# Altium schematic sheet MCU.SchDoc
size A3; SheetNumber: 7; SheetTotal: 7
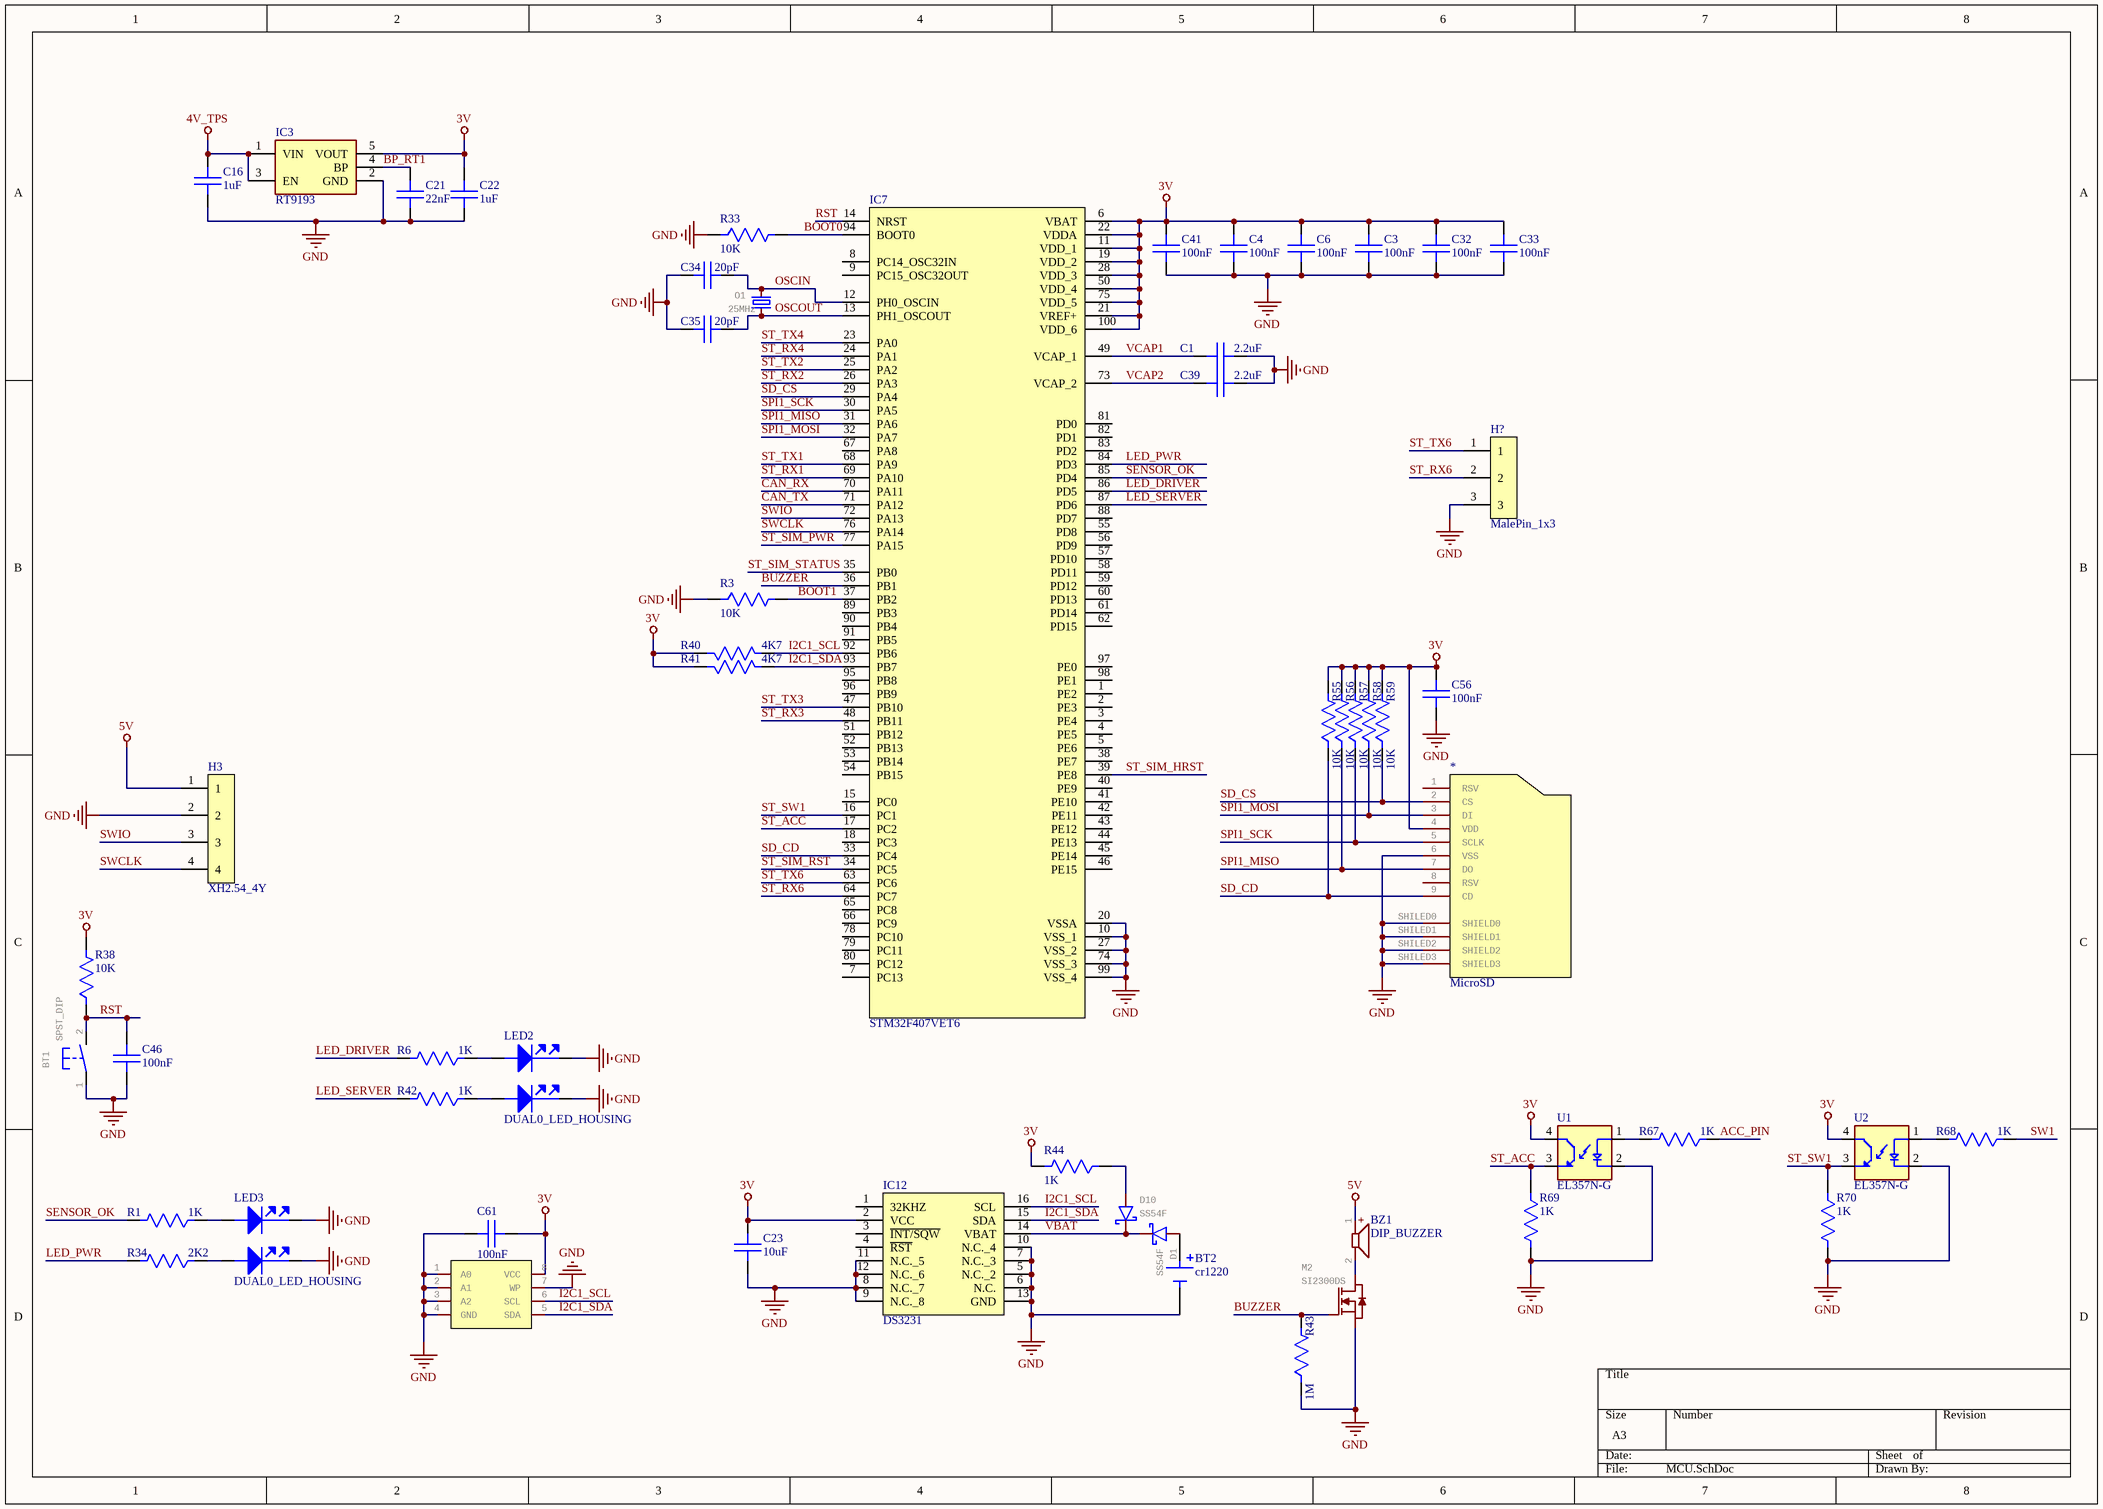
[diagram p0: MCU.SchDoc]

## Parts
*  MicroSD  [SD_MiSD-PP-9P-V1]
BT1  SPST_DIP  [SPST_BUTTON_2DIP]
BT2  cr1220  [cr1220]
BZ1  DIP_BUZZER  [DIP_BUZZER]
C1  2.2uF  [C0603]
C3  100nF  [C0603]
C4  100nF  [C0603]
C6  100nF  [C0603]
C16  1uF  [C0603]
C21  22nF  [C0603]
C22  1uF  [C0603]
C23  10uF  [C0603]
C32  100nF  [C0603]
C33  100nF  [C0603]
C34  20pF  [C0603]
C35  20pF  [C0603]
C39  2.2uF  [C0603]
C41  100nF  [C0603]
C46  100nF  [C0603]
C56  100nF  [C0603]
C61  100nF  [C0603]
D1  SS54F  [SMAF]
D10  SS54F  [SMAF]
H3  XH2.54_4Y  [JST-XH-04-PACKAGE-LONG-PAD]
H?  MalePin_1x3  [MALEPIN_1x3]
IC3  RT9193  [SOT-23-5]
IC7  STM32F407VET6  [LQFP100]
IC11  24LC0XX  [SOIC-8]  (value not drawn)
IC12  DS3231  [SOP-16]
LED2  DUAL0_LED_HOUSING  [DUAL LED HOUSING]
LED3  DUAL0_LED_HOUSING  [DUAL LED HOUSING]
M2  SI2300DS  [SOT23]
O1  25MHz  [CRYSTAL_5032]
R1  1K  [R0603]
R3  10K  [R0603]
R6  1K  [R0603]
R33  10K  [R0603]
R34  2K2  [R0603]
R38  10K  [R0603]
R40  4K7  [R0603]
R41  4K7  [R0603]
R42  1K  [R0603]
R43  1M  [R0603]
R44  1K  [R0603]
R55  10K  [R0603]
R56  10K  [R0603]
R57  10K  [R0603]
R58  10K  [R0603]
R59  10K  [R0603]
R67  1K  [R0603]
R68  1K  [R0603]
R69  1K  [R0603]
R70  1K  [R0603]
U1  EL357N-G  [OPTO_EL357N-G]
U2  EL357N-G  [OPTO_EL357N-G]

## Nets
3V: *.4(VDD) C3.1 C4.1 C6.1 C22.1 C23.1 C32.1 C33.1 C41.1 C56.1 C61.1 IC3.5(VOUT) IC7.6(VBAT) IC7.11(VDD_1) IC7.19(VDD_2) IC7.21(VREF+) IC7.22(VDDA) IC7.28(VDD_3) IC7.50(VDD_4) IC7.75(VDD_5) IC7.100(VDD_6) IC11.8(VCC) IC12.2(VCC) R38.2 R40.1 R41.1 R44.2 R55.2 R56.2 R57.2 R58.2 R59.2 U1.4(CT) U2.4(CT)
4V_TPS: C16.1 IC3.1(VIN) IC3.3(EN)
5V: BZ1.1(+) H3.1
GND: *.6(VSS) *.SHILED0(SHIELD0) *.SHILED1(SHIELD1) *.SHILED2(SHIELD2) *.SHILED3(SHIELD3) BT1.1 BT2.N(NEG) C1.2 C3.2 C4.2 C6.2 C16.2 C21.2 C22.2 C23.2 C32.2 C33.2 C34.2 C35.2 C39.2 C41.2 C46.2 C56.2 C61.2 H3.2 H?.3 IC3.2(GND) IC7.10(VSS_1) IC7.20(VSSA) IC7.27(VSS_2) IC7.74(VSS_3) IC7.99(VSS_4) IC11.1(A0) IC11.2(A1) IC11.3(A2) IC11.4(GND) IC11.7(WP) IC12.5(N.C._2) IC12.6(N.C.) IC12.7(N.C._3) IC12.8(N.C._7) IC12.9(N.C._8) IC12.10(N.C._4) IC12.11(N.C._5) IC12.12(N.C._6) IC12.13(GND) LED2.2 LED2.4 LED3.2 LED3.4 M2.2(S) R3.1 R33.1 R43.1 R69.2 R70.2 U1.2(C) U2.2(C)
ACC_PIN: R67.1
BOOT0: IC7.94(BOOT0) R33.2
BOOT1: IC7.37(PB2) R3.2
BP_RT1: C21.1 IC3.4(BP)
BUZZER: IC7.36(PB1) M2.1(G) R43.2
CAN_RX: IC7.70(PA11)
CAN_TX: IC7.71(PA12)
I2C1_SCL: IC7.92(PB6) IC11.6(SCL) IC12.16(SCL) R40.2
I2C1_SDA: IC7.93(PB7) IC11.5(SDA) IC12.15(SDA) R41.2
LED_DRIVER: IC7.86(PD5) R6.2
LED_PWR: IC7.84(PD3) R34.2
LED_SERVER: IC7.87(PD6) R42.2
OSCIN: C34.1 IC7.12(PH0_OSCIN) O1.2
OSCOUT: C35.1 IC7.13(PH1_OSCOUT) O1.1
RST: BT1.2 C46.1 IC7.14(NRST) R38.1
SD_CD: *.9(CD) IC7.33(PC4) R55.1
SD_CS: *.2(CS) IC7.29(PA4) R59.1
SENSOR_OK: IC7.85(PD4) R1.2
SPI1_MISO: *.7(DO) IC7.31(PA6) R56.1
SPI1_MOSI: *.3(DI) IC7.32(PA7) R58.1
SPI1_SCK: *.5(SCLK) IC7.30(PA5) R57.1
ST_ACC: IC7.17(PC2) R69.1 U1.3(ET)
ST_RX1: IC7.69(PA10)
ST_RX2: IC7.26(PA3)
ST_RX3: IC7.48(PB11)
ST_RX4: IC7.24(PA1)
ST_RX6: H?.2 IC7.64(PC7)
ST_SIM_HRST: IC7.39(PE8)
ST_SIM_PWR: IC7.77(PA15)
ST_SIM_RST: IC7.34(PC5)
ST_SIM_STATUS: IC7.35(PB0)
ST_SW1: IC7.16(PC1) R70.1 U2.3(ET)
ST_TX1: IC7.68(PA9)
ST_TX2: IC7.25(PA2)
ST_TX3: IC7.47(PB10)
ST_TX4: IC7.23(PA0)
ST_TX6: H?.1 IC7.63(PC6)
SW1: R68.1
SWCLK: H3.4 IC7.76(PA14)
SWIO: H3.3 IC7.72(PA13)
VBAT: D1.C D10.C IC12.14(VBAT)
VCAP1: C1.1 IC7.49(VCAP_1)
VCAP2: C39.1 IC7.73(VCAP_2)
NetBT2_P: BT2.P(POS) D1.A
NetBZ1_2: BZ1.2(-) M2.3(D)
NetD10_A: D10.A R44.1
NetLED2_1: LED2.1 R42.1
NetLED2_3: LED2.3 R6.1
NetLED3_1: LED3.1 R34.1
NetLED3_3: LED3.3 R1.1
NetR67_2: R67.2 U1.1(A)
NetR68_2: R68.2 U2.1(A)

Not connected (* = marked no-connect by the designer): * 1(RSV) 8(RSV); IC7 1(PE2) 2(PE3) 3(PE4) 4(PE5) 5(PE6) 7(PC13) 8(PC14_OSC32IN) 9(PC15_OSC32OUT) 15(PC0) 18(PC3) 38(PE7) 40(PE9) 41(PE10) 42(PE11) 43(PE12) 44(PE13) 45(PE14) 46(PE15) 51(PB12) 52(PB13) 53(PB14) 54(PB15) 55(PD8) 56(PD9) 57(PD10) 58(PD11) 59(PD12) 60(PD13) 61(PD14) 62(PD15) 65(PC8) 66(PC9) 67(PA8) 78(PC10) 79(PC11) 80(PC12) 81(PD0) 82(PD1) 83(PD2) 88(PD7) 89(PB3) 90(PB4) 91(PB5) 95(PB8) 96(PB9) 97(PE0) 98(PE1); IC12 1(32KHZ) 3(~{INT/SQW}) 4(~{RST})

## Library data of the parts
BT1 = SPST_DIP: GateName_1: G$1; SymbolName_1: BT1; DeviceSetName: BT4; LibraryName: Uy_SMD; Package: BT4
BT2 = cr1220: BATTERY HOLDER COIN 12MM SMD; MF: MPD; MP: BC501SM; SnapEDA_Link: https://www.snapeda.com/parts/BC501SM/MPD/view-part/?ref=snap; Package: None; Price: None; Availability: Unavailable; Check_prices: https://www.snapeda.com/parts/BC501SM/MPD/view-part/?ref=eda; Value: *
C1 C3 C4 C6 C16 C21-C23 C32-C35 C39 C41 C46 C56 C61 = Capacitor
D1 D10 = SS54F: GateName_1: G$1; SymbolName_1: DIODE_S; LibraryName: Uy_SMD; DeviceSetName: SS54F; Package: SMAF
IC3 = RT9193: Linear Voltage Regulator IC Positive Fixed 1 Output 300mA TSOT-23-5; MP: RT9193-33GB; MF: Richtek USA; SnapEDA_Link: https://www.snapeda.com/parts/RT9193-33GB/Richtek+USA+Inc./view-part/?ref=snap; Package: SOT-23-5 Richtek; Check_prices: https://www.snapeda.com/parts/RT9193-33GB/Richtek+USA+Inc./view-part/?ref=eda; Purchase-URL: https://pricing.snapeda.com/search/part/RT9193-33GB/?ref=eda; Digi-Key_Part_Number: 1028-1014-2-ND; Value: *
IC7 = STM32F407VET6: ARMÂ® CortexÂ®-M4 STM32F4 Microcontroller IC 32-Bit Single-Core 168MHz 512KB (512K x 8) FLASH 100-LQFP (14x14); MF: STMicroelectronics; Check_prices: https://www.snapeda.com/parts/STM32F407VET6/STMicroelectronics/view-part/?ref=eda; Value: *; Availability: In Stock; MP: STM32F407VET6; Price: None; Package: LQFP-100 STMicroelectronics; SnapEDA_Link: https://www.snapeda.com/parts/STM32F407VET6/STMicroelectronics/view-part/?ref=snap; Purchase-URL: https://pricing.snapeda.com/search/part/STM32F407VET6/?ref=eda
IC11 = 24LC0XX: GateName_1: G$1; SymbolName_1: 24LC0XX; LibraryName: Uy_SMD; DeviceSetName: 24LC0XX; Package: SOIC-8
IC12 = DS3231: Real Time Clock (RTC) IC Clock/Calendar - IÂ²C, 2-Wire Serial 16-SOIC (0.295, 7.50mm Width); MF: Maxim Integrated; MP: DS3231S#; Value: *; Price: None; Package: SOIC-16 Maxim; Check_prices: https://www.snapeda.com/parts/DS3231S%23/Maxim+Integrated/view-part/?ref=eda; Availability: In Stock; SnapEDA_Link: https://www.snapeda.com/parts/DS3231S%23/Maxim+Integrated/view-part/?ref=snap; Purchase-URL: https://pricing.snapeda.com/search/part/DS3231S#/?ref=eda
M2 = MOSFETN_SOT23: SOT-23; GateName_1: G$1; SymbolName_1: MOSFET_N; LibraryName: Uy_SMD; DeviceSetName: MOSFETN; Package: SOT23(1)
O1 = CRYSTAL_5032: GateName_1: G$1; SymbolName_1: Q; DeviceName: -9B; LibraryName: Uy_SMD; DeviceSetName: CRYSTAL_5032; Package: 5.0X3.2_2
R1 R3 R6 R33 R34 R38 R40-R44 R55-R59 R67-R70 = Resistor: SMD Resistor 0603; Manufacturer: Yageo; Manufacturer Part Number: RC0603FR-071KL; Power Rating: 100mW; Tolerance: 1%; Value: 1kR; Temperature Coefficient: 100ppm/°C; Voltage Rating: 50V; Supplier: Digi-Key; Supplier Part Number: 311-1.00KHRDKR-ND; RoHS: Yes; Category: Chip SMD Resistors; Stock: 18662657; Pricing: 1=0.1, 10=0.018, 50=0.0106, 100=0.0088, 500=0.00592, 1000=0.00505 (USD); Case/Package: 0603; Case Code (Imperial): 0603; Case Code (Metric): 1608; Contact Plating: Tin,Matte; Min Operating Temperature: -55°C; Max Operating Temperature: 155°C; Packaging: Tape and Reel; Resistor Type: Thick Film; Termination: SMD/SMT; Features: Moisture Resistant; Series: RC; Max Power Dissipation: 100mW; Number of Terminations: 2; Resistance Tolerance: 1%; Construction: Rectangular; Technology: THICK FILM; Length: 1.6mm; Height: 0.45mm; Depth: 0.8mm; Reach SVHC Compliant: No; Military Standard: Not; Lead Free: 5697LeadFree; RoHS Compliant: Yes
U1 U2 = EL357N-G: Optoisolator Transistor Output 3750Vrms 1 Channel 4-SOP (2.54mm); MF: Everlight Electronics; MP: EL357N-G; Price: None; SnapEDA_Link: https://www.snapeda.com/parts/EL357N-G/Everlight+Electronics+Co+Ltd/view-part/?ref=snap; Package: SOP-4 Everlight; Check_prices: https://www.snapeda.com/parts/EL357N-G/Everlight+Electronics+Co+Ltd/view-part/?ref=eda; Value: *; Availability: In Stock; Purchase-URL: https://pricing.snapeda.com/search/part/EL357N-G/?ref=eda